# Altium schematic sheet POWER_INPUT.SchDoc
size Tabloid; SheetNumber: 20; SheetTotal: 25; Sheet_Name: POWER INPUT; Size: 11x17
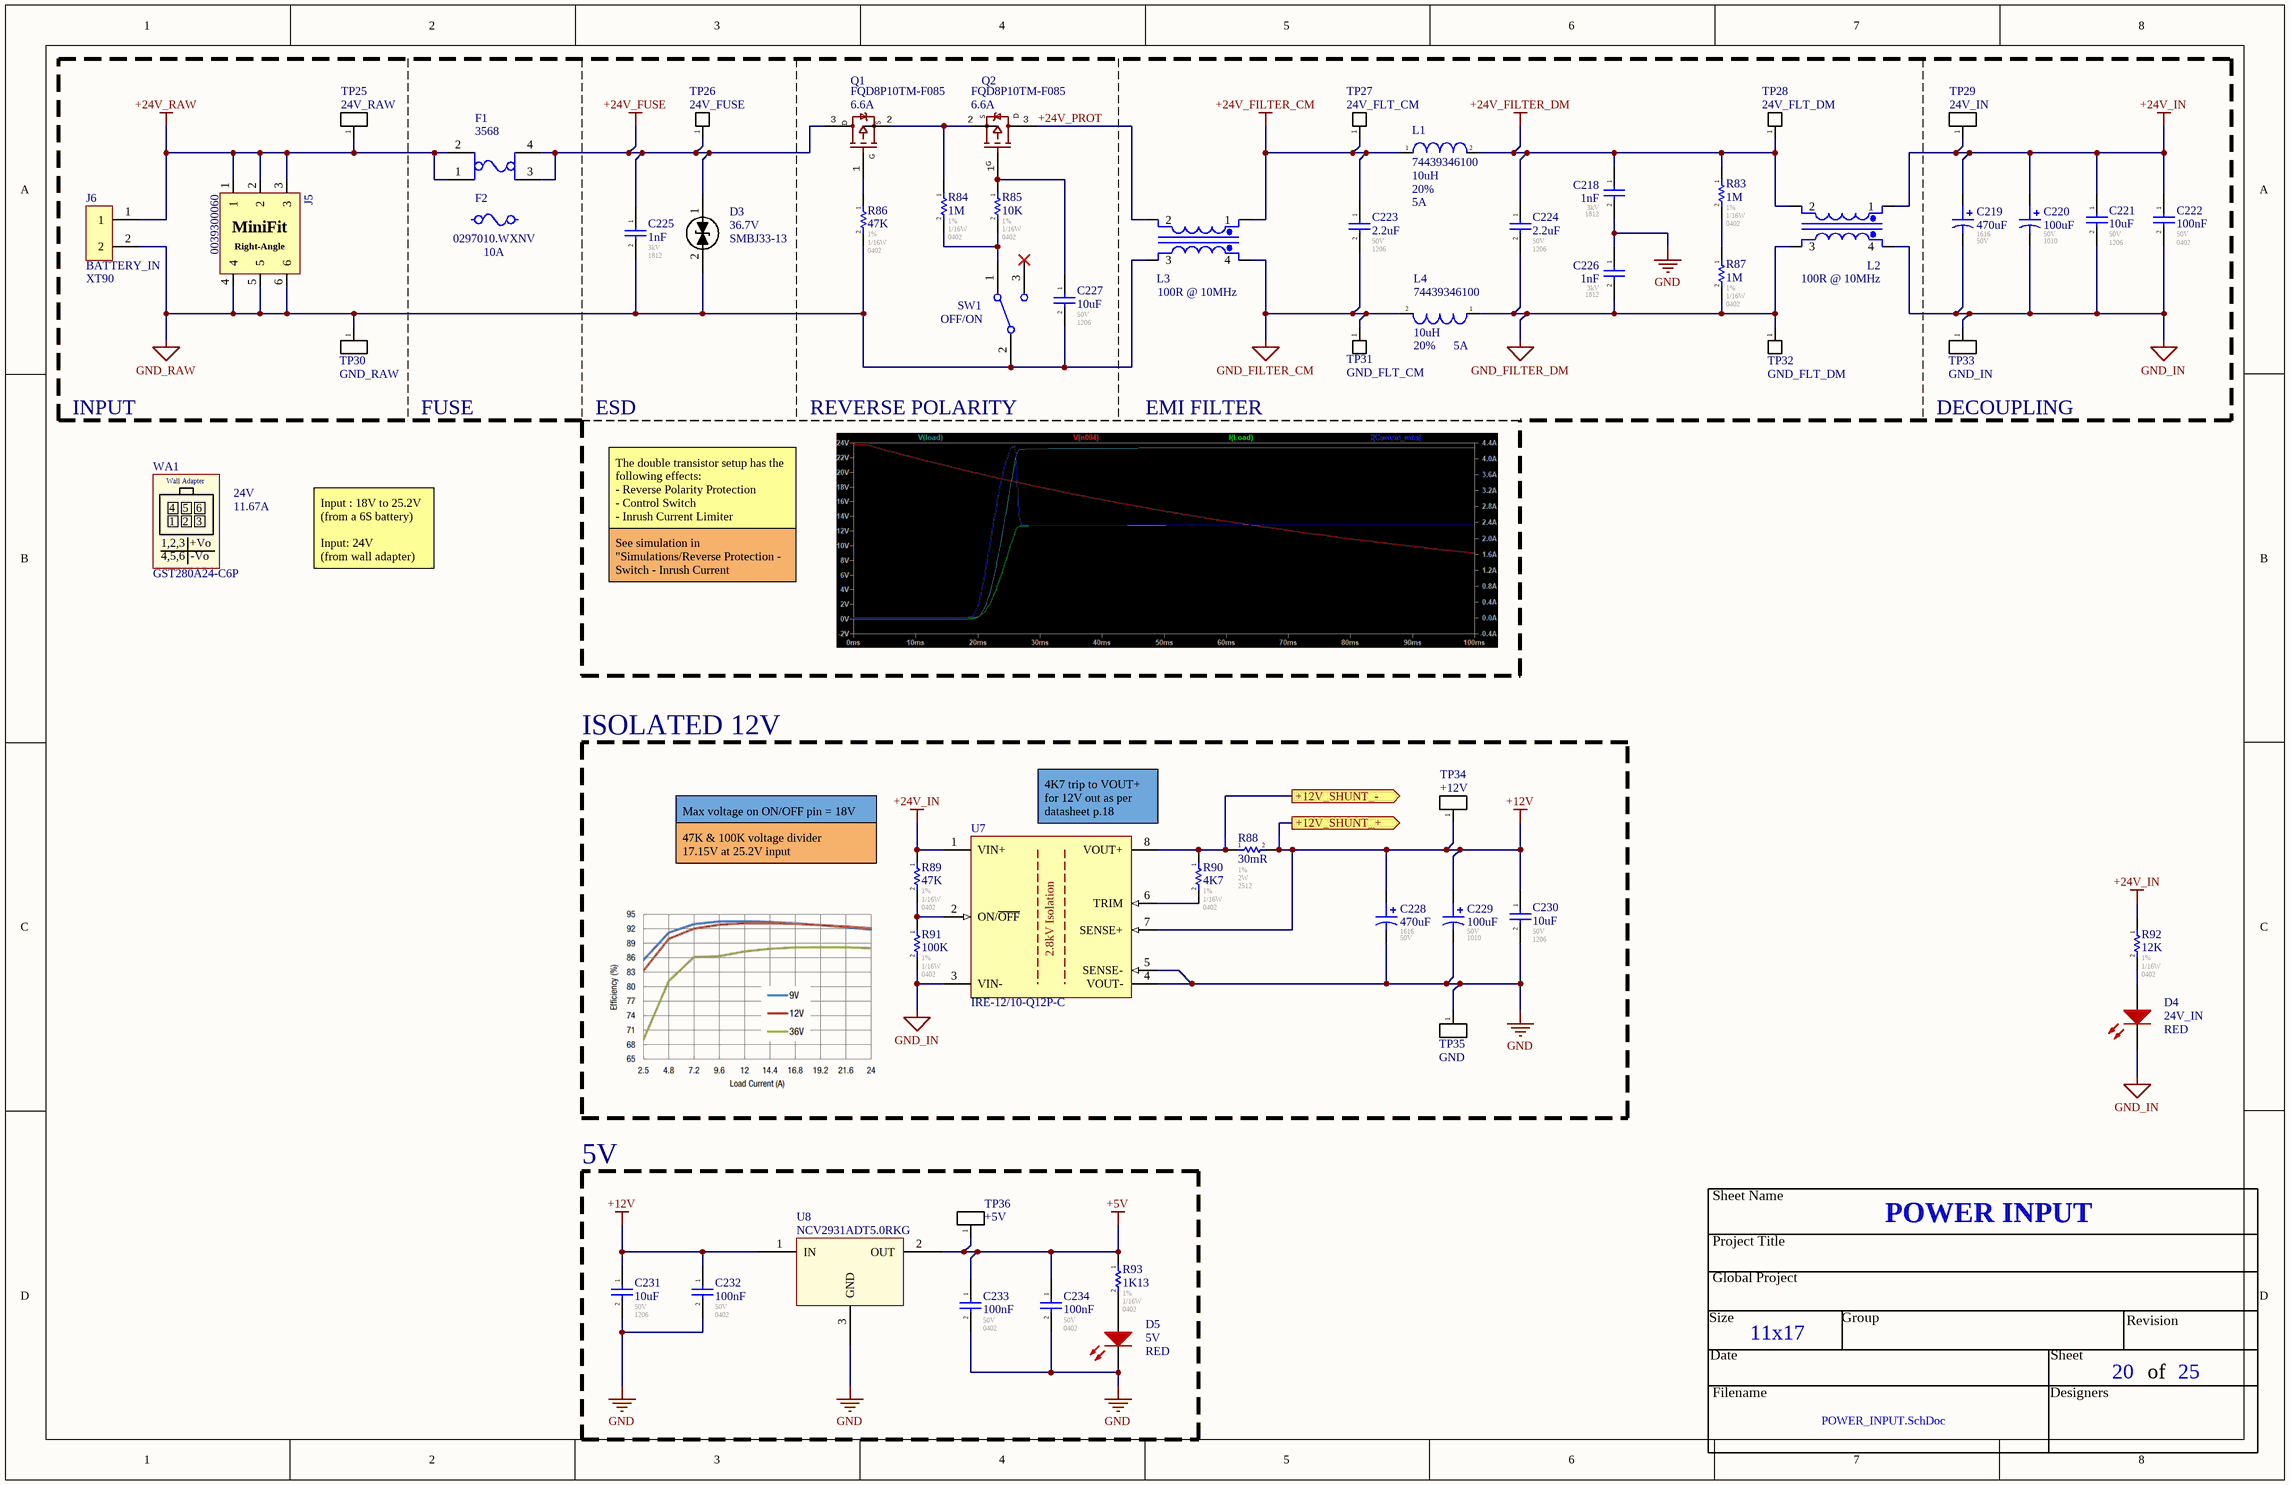
[diagram p0: POWER_INPUT.SchDoc]

## Parts
C218  1nF  Voltage - Rated: 3kV  Footprint: 1812  [CAP_1812]
C219  value 470uF  Voltage: 50V  Package: 1616  [CAP_ALU_1616_vishay]  (hidden comment: MAL214699108E3)
C220  value 100uF  Voltage: 50V  Package: 1010  [CAP_ALU_1010_vishay]  (hidden comment: MAL215099101E3)
C221  10uF  Voltage - Rated: 50V  Footprint: 1206  [CAP_1206]
C222  100nF  Voltage - Rated: 50V  Footprint: 0402  [CAP_0402]
C223  2.2uF  Voltage - Rated: 50V  Footprint: 1206  [CAP_1206]
C224  2.2uF  Voltage - Rated: 50V  Footprint: 1206  [CAP_1206]
C225  1nF  Voltage - Rated: 3kV  Footprint: 1812  [CAP_1812]
C226  1nF  Voltage - Rated: 3kV  Footprint: 1812  [CAP_1812]
C227  10uF  Voltage - Rated: 50V  Footprint: 1206  [CAP_1206]
C228  value 470uF  Voltage: 50V  Package: 1616  [CAP_ALU_1616_vishay]  (hidden comment: MAL214699108E3)
C229  value 100uF  Voltage: 50V  Package: 1010  [CAP_ALU_1010_vishay]  (hidden comment: MAL215099101E3)
C230  10uF  Voltage - Rated: 50V  Footprint: 1206  [CAP_1206]
C231  10uF  Voltage - Rated: 50V  Footprint: 1206  [CAP_1206]
C232  100nF  Voltage - Rated: 50V  Footprint: 0402  [CAP_0402]
C233  100nF  Voltage - Rated: 50V  Footprint: 0402  [CAP_0402]
C234  100nF  Voltage - Rated: 50V  Footprint: 0402  [CAP_0402]
D3  SMBJ33-13  Voltage - Breakdown: 36.7V  [DO214AA (SMB)]
D4  24V_IN  value RED  [LED_0603]
D5  5V  value RED  [LED_0603]
F1  3568  [3568]
F2  0297010.WXNV  Current - Trip: 10A  [0297010.WXNV]
J5  0039300060  [CON_MINIFIT_0039300060]
J6  BATTERY_IN  [XT90]
L1  74439346100  Inductance: 10uH  Tolerance: 20%  Current Rating: 5A  [74439346100]
L2  value 100R @ 10MHz  [IND_PLT10HH101150PNL]  (hidden comment: PLT10HH101150PNL)
L3  value 100R @ 10MHz  [IND_PLT10HH101150PNL]  (hidden comment: PLT10HH101150PNL)
L4  74439346100  Inductance: 10uH  Tolerance: 20%  Current Rating: 5A  [74439346100]
NT38  Net Tie  [NETTIE_5]  (value not drawn)  (net tie, no BOM)
NT39  Net Tie  [NETTIE_5]  (value not drawn)  (net tie, no BOM)
Q1  FQD8P10TM-F085  Current: 6.6A  [DPAK]
Q2  FQD8P10TM-F085  Current: 6.6A  [DPAK]
R83  1M  Tolerance: 1%  Power: 1/16W  Package / Case: 0402  [RES_0402]
R84  1M  Tolerance: 1%  Power: 1/16W  Package / Case: 0402  [RES_0402]
R85  10K  Tolerance: 1%  Power: 1/16W  Package / Case: 0402  [RES_0402]
R86  47K  Tolerance: 1%  Power: 1/16W  Package / Case: 0402  [RES_0402]
R87  1M  Tolerance: 1%  Power: 1/16W  Package / Case: 0402  [RES_0402]
R88  30mR  Tolerance: 1%  Power: 2W  Package / Case: 2512  [RES_2512]
R89  47K  Tolerance: 1%  Power: 1/16W  Package / Case: 0402  [RES_0402]
R90  4K7  Tolerance: 1%  Power: 1/16W  Package / Case: 0402  [RES_0402]
R91  100K  Tolerance: 1%  Power: 1/16W  Package / Case: 0402  [RES_0402]
R92  12K  Tolerance: 1%  Power: 1/16W  Package / Case: 0402  [RES_0402]
R93  1K13  Tolerance: 1%  Power: 1/16W  Package / Case: 0402  [RES_0402]
SW1  OFF/ON  [1101M2S3CQE2]
TP25  24V_RAW  [TP_HOLE]  (no BOM)
TP26  24V_FUSE  [TP_PAD]  (no BOM)
TP27  24V_FLT_CM  [TP_PAD]  (no BOM)
TP28  24V_FLT_DM  [TP_PAD]  (no BOM)
TP29  24V_IN  [TP_HOLE]  (no BOM)
TP30  GND_RAW  [TP_HOLE]  (no BOM)
TP31  GND_FLT_CM  [TP_PAD]  (no BOM)
TP32  GND_FLT_DM  [TP_PAD]  (no BOM)
TP33  GND_IN  [TP_HOLE]  (no BOM)
TP34  +12V  [TP_HOLE]  (no BOM)
TP35  GND  [TP_HOLE]  (no BOM)
TP36  +5V  [TP_HOLE]  (no BOM)
U7  IRE-12/10-Q12P-C  [IRE-Q12]
U8  NCV2931ADT5.0RKG  [DPAK]
WA1  GST280A24-C6P  value 24V  Current Rating: 11.67A  [Model Name]  (mechanical)

## Blocks framed on the sheet
ISOLATED 12V: C228-C230 NT38 NT39 R88-R91 TP34 TP35 U7
5V: C231-C234 D5 R93 TP36 U8

## Ports
+12V_SHUNT_+ (out), +12V_SHUNT_- (out)

## Nets
+5V: C233.1 C234.1 R93.1 TP36.1(A) U8.2(OUT)
+12V: C228.1 C229.1 C230.1 C231.1 C232.1 NT39.1 R88.2 TP34.1(A) U7.7(SENSE+) U8.1(IN)
+24V_FILTER_CM: C223.1 L1.1 L3.1 TP27.1(A)
+24V_FILTER_DM: C218.1 C224.1 L1.2 L2.2 R83.1 TP28.1(A)
+24V_FUSE: C225.1 D3.1(A) F1.3 F1.4 Q1.3 TP26.1(A)
+24V_IN: C219.1 C220.1 C221.1 C222.1 L2.1 R89.1 R92.1 TP29.1(A) U7.1(VIN+)
+24V_RAW: F1.1 F1.2 J5.1 J5.2 J5.3 J6.1 TP25.1(A)
GND: C218.2 C226.1 C228.2 C229.2 C230.2 C231.2 C232.2 C233.2 C234.2 D5.2(K) TP35.1(A) U7.4(VOUT-) U7.5(SENSE-) U8.3(GND)
GND_FILTER_CM: C223.2 L3.4 L4.2 TP31.1(A)
GND_FILTER_DM: C224.2 C226.2 L2.3 L4.1 R87.2 TP32.1(A)
GND_IN: C219.2 C220.2 C221.2 C222.2 D4.2(K) L2.4 R91.2 TP33.1(A) U7.3(VIN-)
GND_RAW: C225.2 C227.2 D3.2(C) J5.4 J5.5 J5.6 J6.2 L3.3 R86.2 SW1.2(P) TP30.1(A)
+12V_SHUNT_+: NT39.2 ; port +12V_SHUNT_+
+12V_SHUNT_-: NT38.2 ; port +12V_SHUNT_-
+24V_PROT: L3.2 Q2.3
NetC227_1: C227.1 Q2.1 R85.1
NetD4_1: D4.1(A) R92.2
NetD5_1: D5.1(A) R93.2
NetNT38_1: NT38.1 R88.1 R90.1 U7.8(VOUT+)
NetQ1_1: Q1.1 R86.1
NetQ1_2: Q1.2 Q2.2 R84.1
NetR83_2: R83.2 R87.1
NetR84_2: R84.2 R85.2 SW1.1(A)
NetR89_2: R89.2 R91.1 U7.2(ON/~{OFF})
NetR90_2: R90.2 U7.6(TRIM)

Not connected (* = marked no-connect by the designer): SW1 3(B)*

## Notes on the sheet
- INPUT
- FUSE
- ESD
- REVERSE POLARITY
- EMI FILTER
- DECOUPLING
- Input : 18V to 25.2V
  (from a 6S battery)
  Input: 24V
  (from wall adapter)
- The double transistor setup has the following effects:
  - Reverse Polarity Protection
  - Control Switch
  - Inrush Current Limiter
- See simulation in "Simulations/Reverse Protection - Switch - Inrush Current Protection.asc"
- Max voltage on ON/OFF pin = 18V
- (near U7) 4K7 trip to VOUT+ for 12V out as per datasheet p.18
- (near R89) 47K & 100K voltage divider
  17.15V at 25.2V input
- Sheet Name
- Project Title
- Global Project
- Revision
- Size
- Date
- Group
- Sheet
- of
- Filename
- Designers
- (in symbol CON_MINIFIT_0039300060) MiniFit; Right-Angle
- (in symbol IRE-24/5-Q12P-C) 2.8kV Isolation
- (in symbol P_CHANNEL) D; S; G
- (in symbol UND_GST280A24-C6P) Wall Adapter; 4; 5; 6; 1; 2; 3; 1,2,3; +Vo; 4,5,6; -Vo

## Library data of the parts
C218 C225 C226 = CAP_CER: C1812C102KHRACAUTO / 0402 470pF 10% X7R Ceramic Capacitor; Mfr: KEMET; Operating Temperature: -55C - 125C; Temperature Coefficient: X7R; ComponentLink1Description: Digikey; ComponentLink1URL: https://www.digikey.com/en/products/detail/kemet/C1812C102KHRACAUTO/8109956; Part#: C1812C102KHRACAUTO; ComponentLink2Description: Datasheet; ComponentLink2URL: https://connect.kemet.com:7667/gateway/IntelliData-ComponentDocumentation/1.0/download/datasheet/C1812C102KHRACAUTO; Tolerance: 10%; Ratings: AEC-Q200; ComponentLink3Description: KEMET; ComponentLink3URL: https://www.kemet.com/en/us/capacitors/ceramic/product/C1812C102KHRACAUTO.html; ComponentLink4Description: Octopart; ComponentLink4URL: https://octopart.com/c1812c102khracauto-kemet-67309371?r=sp; Features: Low ESL, High Voltage; Supplier 1: Mouser; Supplier Part Number 1: 80-C1812C102KHRAUTO
C219 C228 = CAP_ALU_MAL214699108E3: CAP - ALU 470uF 20% 50V - 1616; Current: 1.3A; Mfg: Vishay Dale; Mfg Part Number: MAL214699108E3; HelpURL: http://www.vishay.com/docs/28403/146cti.pdf; CreatedBy: Jonathan Bouchard; Temperature: -55°C to 125°C; Power: *; Supplier 1: Digikey; Supplier Part Number 1: 4442PHCT-ND; Precision: 20%
C220 C229 = CAP_ALU_MAL215099101E3: CAP - ALU 100uF 20% 50V - 1010; Current: 490mA; Mfg: Vishay Dale; Mfg Part Number: MAL215099101E3; HelpURL: http://www.vishay.com/docs/28395/150crz.pdf; CreatedBy: Jonathan Bouchard; Temperature: -55°C to 125°C; Power: *; Supplier 1: Digikey; Supplier Part Number 1: 4399PHDKR-ND; Precision: 20%
C221 C227 C230 C231 = CAP_CER: GRT31CR61H106KE01L / 1206 10uF 10% X5R Ceramic Capacitor; Mfr: Murata; Operating Temperature: -55C - 85C; Temperature Coefficient: X5R; ComponentLink1Description: Digikey; ComponentLink1URL: [Digikey Link]; ComponentLink2Description: Datasheet; ComponentLink2URL: [Datasheet Link]; Tolerance: 10%; Ratings: AEC-Q200; Part#: GRT31CR61H106KE01L
  C221 C230 C231: Supplier 1: Arrow Electronics; Supplier Part Number 1: GRT31CR61H106KE01L
C222 C232-C234 = CAP_CER: GCM155R71H104KE02J / 0402 100nF 10% X7R Ceramic Capacitor; Mfr: Murata; Operating Temperature: -55C - 125C; Temperature Coefficient: X7R; ComponentLink1Description: Digikey; ComponentLink1URL: [Digikey Link]; Part#: GCM155R71H104KE02J; ComponentLink2Description: Datasheet; ComponentLink2URL: [Datasheet Link]; Tolerance: 10%; Ratings: AEC-Q200
C223 C224 = CAP_CER: GRT31CR71H225KE13L / 1206 2.2uF 10% X7R Ceramic Capacitor; Mfr: Murata; Operating Temperature: -55C - 125C; Temperature Coefficient: X7R; ComponentLink1Description: Digikey; ComponentLink1URL: https://www.digikey.ca/en/products/detail/murata-electronics/GRT31CR71H225KE13L/10700891; Part#: GRT31CR71H225KE13L; ComponentLink2Description: Datasheet; ComponentLink2URL: https://search.murata.co.jp/Ceramy/image/img/A01X/G101/ENG/GRT31CR71H225KE13-01A.pdf; ComponentLink3Description: Octopart; ComponentLink3URL: https://octopart.com/grt31cr71h225ke13l-murata-76584457?r=sp; ComponentLink4Description: Murata; ComponentLink4URL: https://www.murata.com/en-us/products/productdetail?partno=GRT31CR71H225KE13%23; Tolerance: 10%; Ratings: AEC-Q200
D3 = DIODE_TVS: 53.3V Clamp 11.3A Ipp Tvs Diode Surface Mount SMB; Mfr: SMBJ33CAQ-13-F; Voltage - Reverse: 33V; Operating Temperature: *; Package / Case: SMB; Current: 11.3A; ComponentLink1Description: Digikey; ComponentLink1URL: https://www.digikey.ca/en/products/detail/diodes-incorporated/SMBJ33CAQ-13-F/9738859
D4 D5 = LED_SML-311UTT86: LED - 620nM RED 2mA - 0603; Voltage: 1.8V; Mfg: ROHM Semiconductor; Power: 44mW; Current: 2mA; HelpURL: http://media.digikey.com/pdf/Data%20Sheets/Rohm%20PDFs/SML-311%20Series.pdf; CreatedBy: Jonathan Bouchard; Temperature: -30°C to 85°C; Package: 0603; Precision: *; Mfg Part Number: SML-311UTT86; Supplier 1: Digikey; Supplier Part Number 1: 511-1304-1-ND
F1 = FUSE_HOLDER_3568: FUSE HOLDER BLADE; Mfr: Keystone; Voltage Rating: 500V; Current - Max: 30A; Operating Temperature: -50C - 145C; Created By: Pascal-Emmanuel Lachance
F2 = FUSE_0297010.WXNV: FUSE AUTO 10A 32V BLADE MINI; Mfr: Littelfuse; Current - Max: 40A; Time to Trip: 100ms; Resistance: 7.42mR; Rule: UNIONINDEX=0|RULEKIND=ComponentClearance|NETSCOPE=AnyNet|LAYERKIND=SameLayer|NAME=Schematic Component Clearance Constraint|GAP=-1mil|COLLISIONCHECKMODE=3|VERTICALGAP=10mil|SHOWDISTANCES=FALSE|UNIT=Imperial; Voltage Rating: 32V; Operating Temperature: -40C - 125C; Package / Case: BLADE MINI AUTO; Current - Hold: 10A; ComponentLink1Description: Datasheet; ComponentLink1URL: https://www.littelfuse.com/~/media/automotive/datasheets/fuses/passenger-car-and-commercial-vehicle/blade-fuses/littelfuse_mini_datasheet.pdf; ComponentLink2Description: Digikey; ComponentLink2URL: https://www.digikey.ca/en/products/detail/littelfuse-inc/0297010-WXNV/146591; Created By: Pascal-Emmanuel Lachance; ComponentLink3Description: Mouser; ComponentLink3URL: https://www.mouser.ca/ProductDetail/Littelfuse/0297010WXNV; ComponentLink4Description: Octopart; ComponentLink4URL: https://octopart.com/0297010.wxnv-littelfuse-566872
J5 = CON_MINIFIT_0039300060: CON - Mini-Fit Through Hole, Right Angle 6 position; Manufacturer #1: Molex; Current Rating: 8A; GRAMS Lib Spec: 2.8; Magnetic Material: Unknown; Polarized: Yes; Voltage Rating: 600V; Assembly Type: TH; CreatedBy/Date: Joel Lemay 2018-06-21; HelpURL: https://www.molex.com/pdm_docs/sd/039300060_sd.pdf; Manufacturer #2: *; Package: TH; Part Number #1: 0039300060; Part Number #2: *; Power Max: *; Supplier 1: Digi-Key; Supplier Part Number 1: WM21353-ND; Temperature: - 40°C to + 80°C; Tolerance: *; Value: *; VerifiedBy: Caroline Paulin - 10 sept 2018; Cryo: UNKNOWN
J6 = XT90: Current (Continuous): 90A; Resistance: 0.8 Ohm; Operating Temperature: -20C - 120C; Type: XT90
L1 L4 = INDUCTOR: Generic Inductor; Material: Metal Composite; Resistance: 25.5mR; Operating Temperature: -40C - 125C; Package / Case: Nonstandard; Ratings: AEC-Q200; Q @ Freq: -; ComponentLink1Description: Digikey; ComponentLink1URL: https://www.digikey.ca/en/products/detail/w%C3%BCrth-elektronik/74439346100/6236306; ComponentLink2Description: Datasheet; ComponentLink2URL: https://www.we-online.com/components/products/datasheet/74439346100.pdf; ComponentLink3Description: Octopart; ComponentLink3URL: https://octopart.com/74439346100-wurth+elektronik-75811204?r=sp; Supplier 1: Digikey; Supplier Part Number 1: 732-10707-1-ND
L2 L3 = IND_PLT10HH101150PNL: IND - 2 Line Common Mode Choke Surface Mount 100 Ohms @ 10MHz 15A DCR 2.3 mOhm - SMD (12.9mm L x 6.6mm W x 9.4mm H); Manufacturer #1: Murata Electronics North America; Voltage Rating: 300VDC; GRAMS Lib Spec: 2.8; Magnetic Material: Yes; Polarized: No; Cryo: UNKNOWN; Tolerance: *; Current Rating: 15A; Power Max: *; HelpURL: https://www.murata.com/en-eu/products/productdata/8796754935838/QFLB9101.pdf; CreatedBy/Date: Tommy Rossginol - 2019/04/09; VerifiedBy: Caroline Paulin - 10-04-2019; Temperature: -55°C ~ 125°C; Package: SMD (12.9mm L x 6.6mm W x 9.4mm H); Manufacturer #2: *; Assembly Type: SMD; Part Number #2: *; Part Number #1: PLT10HH101150PNL; Supplier 1: Digi-Key; Supplier Part Number 1: 490-12821-1-ND
NT38 NT39 = NET_TIE_SMALL
Q1 Q2 = P_CHANNEL: P-Channel 100 V 6.6A (Tc) 2.5W (Ta), 44W (Tc) Surface Mount TO-252AA; Mfr: onsemi; Vds: 100V; Rds ON: 530mΩ @ 3.3A,10V; Vgs: 4V @ 250µA; Vgs (max): 30V; Qualification: AEC-Q101; Package / Case: DPAK; Operating Temperature: -55C - 150C; ComponentLink1Description: Digikey; ComponentLink1URL: https://www.digikey.ca/en/products/detail/onsemi/FQD8P10TM-F085/2602606; ComponentLink2Description: Datasheet; ComponentLink2URL: https://www.onsemi.com/pdf/datasheet/fqd8p10tm_f085-d.pdf
R83 R84 R87 = RESISTOR: 1M 0402 1% 1/16W Resistor; Automotive: AEC-Q200; Operating Temperature: *; # Digikey: *; ComponentLink1Description: Digikey; ComponentLink1URL: *; # Manufacturer: *
R85 R86 R89-R93 = RESISTOR: Automotive: AEC-Q200; Operating Temperature: *; # Digikey: *; ComponentLink1Description: Digikey; ComponentLink1URL: *; # Manufacturer: *
R88 = RESISTOR: CSRN2512FK30L0; Automotive: AEC-Q200; Operating Temperature: -55C - 155C; ComponentLink1Description: Digikey; ComponentLink1URL: https://www.digikey.ca/fr/products/detail/stackpole-electronics-inc/CSRN2512FK30L0/1646107; Part #: CSRN2512FK30L0
SW1 = SPDT_SWITCH: 1103M2S3CQE2 / Slide Switch SPDT Through Hole; Mfr: C&K; Switch Function: On-Off-On; Current Rating: 6A; Voltage Rating - AC: 120V; Voltage Rating - DC: 28V; Cycles: 40000; Operating Temperature: -30C - 65C; ComponentLink1Description: Digikey; ComponentLink1URL: https://www.digikey.ca/en/products/detail/c-k/1103M2S3CQE2/483721; ComponentLink2Description: Datasheet; ComponentLink2URL: https://www.ckswitches.com/media/1429/1000.pdf; ComponentLink3Description: Octopart; ComponentLink3URL: https://octopart.com/1103m2s3cqe2-c%26k+components-2492778?r=sp; Supplier 1: Arrow Electronics; Supplier Part Number 1: 1103M2S3CQE2
TP25 TP29 TP30 TP33-TP36 = TESTPOINT: Test Point; ClassName: Testpoint
TP26-TP28 TP31 TP32 = TESTPOINT_PAD: Test Point
U7 = IRE-24/5-Q12P-C: Isolated DC/DC Converters - Through Hole 9V-36VIN 24VOUT 120W; Mfr: Murata; Voltage - Output: 12V; Current - Output: 10A; Voltage - Input (Min): 9V; Voltage - Input (Max): 36V; Isolation Voltage: 2.828kV; Switching Frequency: 240kHz; Output Power: 120W; Operating Temperature: -40C - 85C; ComponentLink1Description: Mouser; ComponentLink1URL: https://www.mouser.ca/ProductDetail/Murata-Power-Solutions/IRE-12-10-Q12NF-C?qs=xZ%2FP%252Ba9zWqYdIxrb6V0e3g%3D%3D; ComponentLink2Description: Murata; ComponentLink2URL: https://www.murata.com/en-us/products/productdetail?partno=IRE-12%2F10-Q12P-C; ComponentLink3Description: Datasheet; ComponentLink3URL: https://www.murata.com/products/productdata/8807029112862/ire-q12.pdf?1655388012000; ComponentLink4Description: Octopart; ComponentLink4URL: https://octopart.com/ire-12%2F10-q12nf-c-murata+power+solutions-107236518?r=sp; Supplier 1: Digikey; Supplier Part Number 1: 811-IRE-12/10-Q12P-C-ND; ComponentLink5Description: Digikey; ComponentLink5URL: https://www.digikey.ca/en/products/detail/murata-power-solutions-inc/IRE-12-10-Q12P-C/11503740
WA1 = UND_GST280A24-C6P: UND - AC/DC DESKTOP ADAPTER 24V 280W - MEC; Manufacturer #1: MEAN WELL USA Inc.; Tolerance: ±3%; Voltage Rating: 85~264VAC; GRAMS Lib Spec: 2.8; Magnetic Material: Unknown; Polarized: Yes; Power Max: 280W; HelpURL: https://www.meanwell.com/Upload/PDF/GST280A/GST280A-SPEC.PDF; CreatedBy/Date: Caroline Paulin - 5 avril 2019; VerifiedBy: Nicolas V. (2019-07-05); Temperature: -30°C to +70°C; Package: -; Manufacturer #2: *; Note: *; Assembly Type: -; Part Number #2: *; Part Number #1: GST280A24-C6P; Supplier 1: Digi-Key; Supplier Part Number 1: 1866-2122-ND; Cryo: UNKNOWN
U8 = NCV2931ADT5.0RKG: Supplier 1: Mouser; Supplier Part Number 1: 863-NCV2931ADT5.0RKG; ComponentLink1Description: Digikey; ComponentLink1URL: https://www.digikey.com/en/products/detail/onsemi/NCV2931ADT5-0RKG/1961138